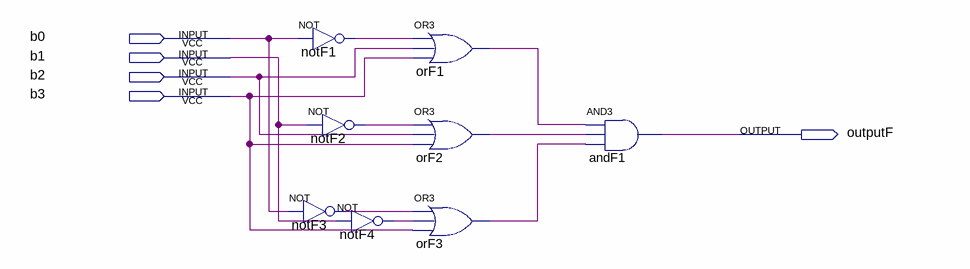
[diagram p0: schematic sheet]
// Quartus schematic f.bdf as structural Verilog: 8 symbols, 5 pins
module f (
  input  b0,
  input  b1,
  input  b2,
  input  b3,
  output outputF
);

  wire notF1_out, notF2_out, notF3_out, notF4_out, orF1_out, orF2_out, orF3_out;

  not notF3 (notF3_out, b0);
  not notF1 (notF1_out, b0);
  not notF2 (notF2_out, b1);
  not notF4 (notF4_out, b1);
  or orF1 (orF1_out, notF1_out, b2, b3);
  or orF2 (orF2_out, notF2_out, b2, b3);
  or orF3 (orF3_out, notF3_out, notF4_out, b3);
  and andF1 (outputF, orF1_out, orF2_out, orF3_out);
endmodule
